# Altium schematic sheet RK3568-SOM-MAIN.SchDoc
size A2; Organization: Altium Limited; Address1: L3, 12a Rodborough Rd; Address2: Frenchs Forest; Address3: NSW; Address4: Australia 2086
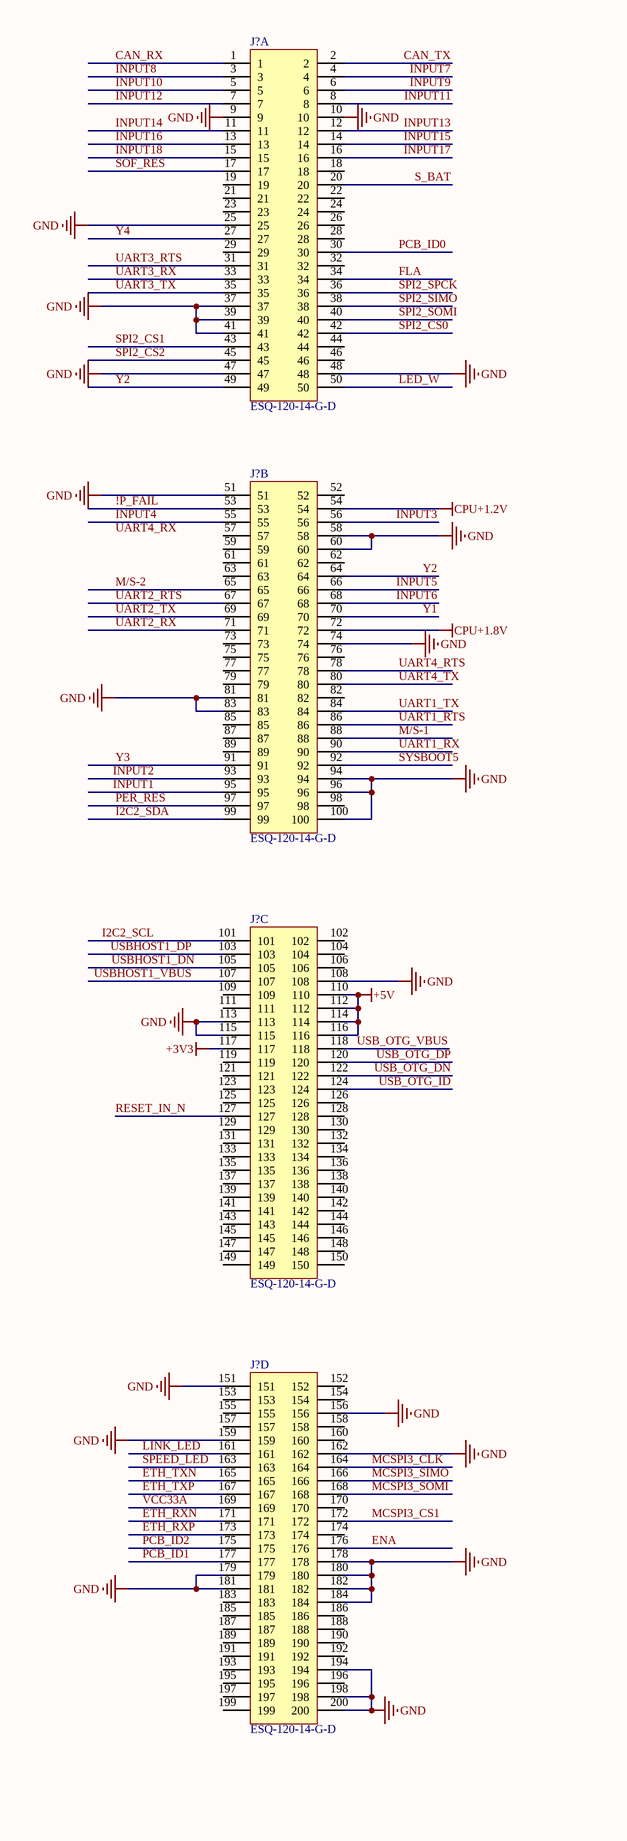
[diagram p0: RK3568-SOM-MAIN.SchDoc, left]
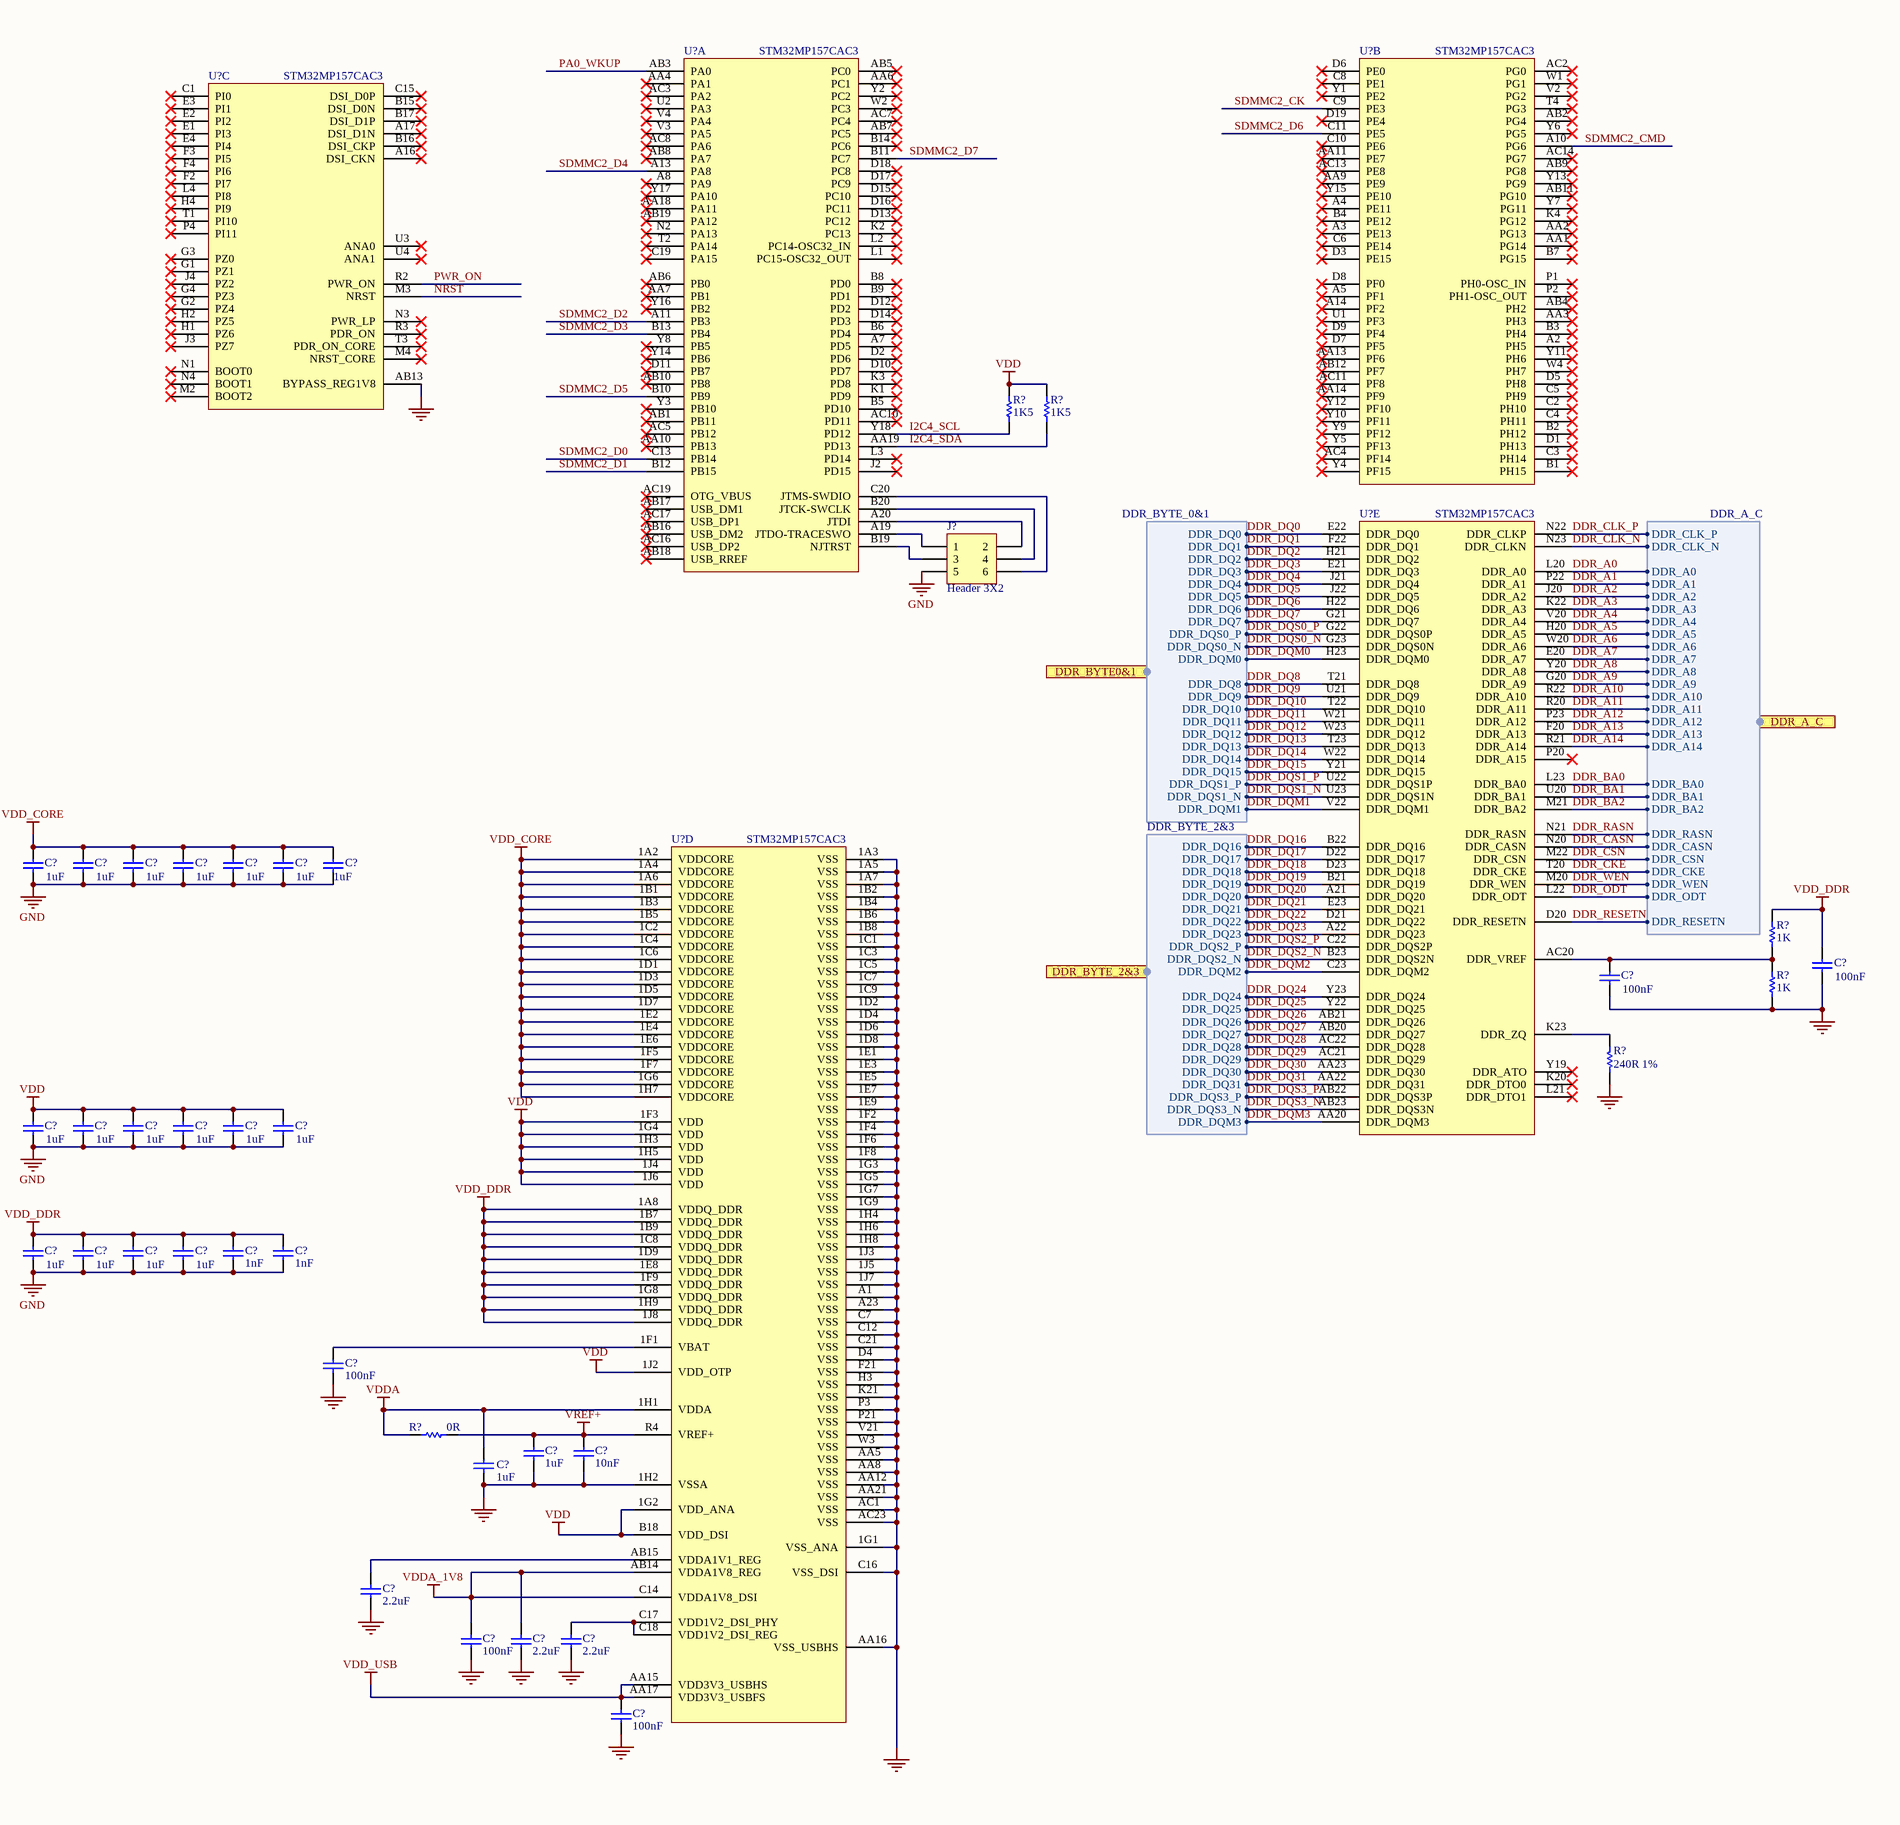
[diagram p1: RK3568-SOM-MAIN.SchDoc, right]

## Parts
(Parts that share a designator on the sheet are numbered #1, #2 ... from top to bottom, then left to right.)
C?#1  value 1uF  [C0402]  (hidden comment: Capacitor)
C?#2  value 1uF  [C0402]  (hidden comment: Capacitor)
C?#3  value 1uF  [C0402]  (hidden comment: Capacitor)
C?#4  value 1uF  [C0402]  (hidden comment: Capacitor)
C?#5  value 1uF  [C0402]  (hidden comment: Capacitor)
C?#6  value 1uF  [C0402]  (hidden comment: Capacitor)
C?#7  value 1uF  [C0402]  (hidden comment: Capacitor)
C?#8  value 100nF  [C0402]  (hidden comment: Capacitor)
C?#9  value 100nF  [C0402]  (hidden comment: Capacitor)
C?#10  value 1uF  [C0402]  (hidden comment: Capacitor)
C?#11  value 1uF  [C0402]  (hidden comment: Capacitor)
C?#12  value 1uF  [C0402]  (hidden comment: Capacitor)
C?#13  value 1uF  [C0402]  (hidden comment: Capacitor)
C?#14  value 1uF  [C0402]  (hidden comment: Capacitor)
C?#15  value 1uF  [C0402]  (hidden comment: Capacitor)
C?#16  value 1uF  [C0402]  (hidden comment: Capacitor)
C?#17  value 1uF  [C0402]  (hidden comment: Capacitor)
C?#18  value 1uF  [C0402]  (hidden comment: Capacitor)
C?#19  value 1uF  [C0402]  (hidden comment: Capacitor)
C?#20  value 1nF  [C0402]  (hidden comment: Capacitor)
C?#21  value 1nF  [C0402]  (hidden comment: Capacitor)
C?#22  value 100nF  [C0402]  (hidden comment: Capacitor)
C?#23  value 1uF  [C0402]  (hidden comment: Capacitor)
C?#24  value 10nF  [C0402]  (hidden comment: Capacitor)
C?#25  value 1uF  [C0402]  (hidden comment: Capacitor)
C?#26  value 2.2uF  [C0402]  (hidden comment: Capacitor)
C?#27  value 100nF  [C0402]  (hidden comment: Capacitor)
C?#28  value 2.2uF  [C0402]  (hidden comment: Capacitor)
C?#29  value 2.2uF  [C0402]  (hidden comment: Capacitor)
C?#30  value 100nF  [C0402]  (hidden comment: Capacitor)
J?#1  ESQ-120-14-G-D  [ESQ-120-14-G-D]  (part A of 4)
J?#2  Header 3X2  [Header3x2]
J?#3  ESQ-120-14-G-D  [ESQ-120-14-G-D]  (part B of 4)
J?#4  ESQ-120-14-G-D  [ESQ-120-14-G-D]  (part C of 4)
J?#5  ESQ-120-14-G-D  [ESQ-120-14-G-D]  (part D of 4)
R?#1  value 1K5  [R0402]  (hidden comment: Resistor)
R?#2  value 1K5  [R0402]  (hidden comment: Resistor)
R?#3  value 1K  [R0402]  (hidden comment: Resistor)
R?#4  value 1K  [R0402]  (hidden comment: Resistor)
R?#5  value 240R 1%  [R0402]  (hidden comment: Resistor)
R?#6  value 0R  [R0402]  (hidden comment: Resistor)
U?#1  STM32MP157CAC3  [ICC_TFBGA361_12X12_STM32MP157CAC3_P050-065]  (part A of 5)
U?#2  STM32MP157CAC3  [ICC_TFBGA361_12X12_STM32MP157CAC3_P050-065]  (part B of 5)
U?#3  STM32MP157CAC3  [ICC_TFBGA361_12X12_STM32MP157CAC3_P050-065]  (part C of 5)
U?#4  STM32MP157CAC3  [ICC_TFBGA361_12X12_STM32MP157CAC3_P050-065]  (part E of 5)
U?#5  STM32MP157CAC3  [ICC_TFBGA361_12X12_STM32MP157CAC3_P050-065]  (part D of 5)

## Ports
DDR_A_C (harness DDR_A_C), DDR_BYTE0&1 (harness DDR_BYTE_0&1), DDR_BYTE_2&3 (harness DDR_BYTE_2&3)

## Harnesses
DDR_BYTE_0&1: DDR_DQ0, DDR_DQ1, DDR_DQ2, DDR_DQ3, DDR_DQ4, DDR_DQ5, DDR_DQ6, DDR_DQ7, DDR_DQS0_P, DDR_DQS0_N, DDR_DQM0, DDR_DQ8, DDR_DQ9, DDR_DQ10, DDR_DQ11, DDR_DQ12, DDR_DQ13, DDR_DQ14, DDR_DQ15, DDR_DQS1_P, DDR_DQS1_N, DDR_DQM1
DDR_A_C: DDR_CLK_P, DDR_CLK_N, DDR_A0, DDR_A1, DDR_A2, DDR_A3, DDR_A4, DDR_A5, DDR_A6, DDR_A7, DDR_A8, DDR_A9, DDR_A10, DDR_A11, DDR_A12, DDR_A13, DDR_A14, DDR_BA0, DDR_BA1, DDR_BA2, DDR_RASN, DDR_CASN, DDR_CSN, DDR_CKE, DDR_WEN, DDR_ODT, DDR_RESETN
DDR_BYTE_2&3: DDR_DQ16, DDR_DQ17, DDR_DQ18, DDR_DQ19, DDR_DQ20, DDR_DQ21, DDR_DQ22, DDR_DQ23, DDR_DQS2_P, DDR_DQS2_N, DDR_DQM2, DDR_DQ24, DDR_DQ25, DDR_DQ26, DDR_DQ27, DDR_DQ28, DDR_DQ29, DDR_DQ30, DDR_DQ31, DDR_DQS3_P, DDR_DQS3_N, DDR_DQM3

## Nets
+3V3: J?#4.117
+5V: J?#4.110 J?#4.112 J?#4.114 J?#4.116
CPU+1.2V: J?#3.54
CPU+1.8V: J?#3.72
GND: C?#1.1 C?#2.1 C?#3.1 C?#4.1 C?#5.1 C?#6.1 C?#7.1 C?#8.1 C?#9.1 C?#10.1 C?#11.1 C?#12.1 C?#13.1 C?#14.1 C?#15.1 C?#16.1 C?#17.1 C?#18.1 C?#19.1 C?#20.1 C?#21.1 C?#22.1 C?#23.1 C?#24.1 C?#25.1 C?#26.1 C?#27.1 C?#28.1 C?#29.1 C?#30.1 J?#1.9 J?#1.10 J?#1.25 J?#1.37 J?#1.39 J?#1.41 J?#1.47 J?#1.48 J?#2.5 J?#3.51 J?#3.58 J?#3.60 J?#3.74 J?#3.81 J?#3.83 J?#3.94 J?#3.96 J?#3.100 J?#4.108 J?#4.113 J?#4.115 J?#5.151 J?#5.156 J?#5.159 J?#5.162 J?#5.178 J?#5.179 J?#5.180 J?#5.181 J?#5.182 J?#5.184 J?#5.194 J?#5.198 J?#5.200 R?#4.1 R?#5.2 U?#3.AB13(BYPASS_REG1V8) U?#5.1A3(VSS) U?#5.1A5(VSS) U?#5.1A7(VSS) U?#5.1B2(VSS) U?#5.1B4(VSS) U?#5.1B6(VSS) U?#5.1B8(VSS) U?#5.1C1(VSS) U?#5.1C3(VSS) U?#5.1C5(VSS) U?#5.1C7(VSS) U?#5.1C9(VSS) U?#5.1D2(VSS) U?#5.1D4(VSS) U?#5.1D6(VSS) U?#5.1D8(VSS) U?#5.1E1(VSS) U?#5.1E3(VSS) U?#5.1E5(VSS) U?#5.1E7(VSS) U?#5.1E9(VSS) U?#5.1F2(VSS) U?#5.1F4(VSS) U?#5.1F6(VSS) U?#5.1F8(VSS) U?#5.1G1(VSS_ANA) U?#5.1G3(VSS) U?#5.1G5(VSS) U?#5.1G7(VSS) U?#5.1G9(VSS) U?#5.1H2(VSSA) U?#5.1H4(VSS) U?#5.1H6(VSS) U?#5.1H8(VSS) U?#5.1J3(VSS) U?#5.1J5(VSS) U?#5.1J7(VSS) U?#5.A1(VSS) U?#5.A23(VSS) U?#5.AA5(VSS) U?#5.AA8(VSS) U?#5.AA12(VSS) U?#5.AA16(VSS_USBHS) U?#5.AA21(VSS) U?#5.AC1(VSS) U?#5.AC23(VSS) U?#5.C7(VSS) U?#5.C12(VSS) U?#5.C16(VSS_DSI) U?#5.C21(VSS) U?#5.D4(VSS) U?#5.F21(VSS) U?#5.H3(VSS) U?#5.K21(VSS) U?#5.P3(VSS) U?#5.P21(VSS) U?#5.V21(VSS) U?#5.W3(VSS)
VDD: C?#10.2 C?#11.2 C?#12.2 C?#13.2 C?#14.2 C?#15.2 R?#1.1 R?#2.1 U?#5.1F3(VDD) U?#5.1G2(VDD_ANA) U?#5.1G4(VDD) U?#5.1H3(VDD) U?#5.1H5(VDD) U?#5.1J2(VDD_OTP) U?#5.1J4(VDD) U?#5.1J6(VDD) U?#5.B18(VDD_DSI)
VDD_CORE: C?#1.2 C?#2.2 C?#3.2 C?#4.2 C?#5.2 C?#6.2 C?#7.2 U?#5.1A2(VDDCORE) U?#5.1A4(VDDCORE) U?#5.1A6(VDDCORE) U?#5.1B1(VDDCORE) U?#5.1B3(VDDCORE) U?#5.1B5(VDDCORE) U?#5.1C2(VDDCORE) U?#5.1C4(VDDCORE) U?#5.1C6(VDDCORE) U?#5.1D1(VDDCORE) U?#5.1D3(VDDCORE) U?#5.1D5(VDDCORE) U?#5.1D7(VDDCORE) U?#5.1E2(VDDCORE) U?#5.1E4(VDDCORE) U?#5.1E6(VDDCORE) U?#5.1F5(VDDCORE) U?#5.1F7(VDDCORE) U?#5.1G6(VDDCORE) U?#5.1H7(VDDCORE)
VDD_DDR: C?#8.2 C?#16.2 C?#17.2 C?#18.2 C?#19.2 C?#20.2 C?#21.2 R?#3.2 U?#5.1A8(VDDQ_DDR) U?#5.1B7(VDDQ_DDR) U?#5.1B9(VDDQ_DDR) U?#5.1C8(VDDQ_DDR) U?#5.1D9(VDDQ_DDR) U?#5.1E8(VDDQ_DDR) U?#5.1F9(VDDQ_DDR) U?#5.1G8(VDDQ_DDR) U?#5.1H9(VDDQ_DDR) U?#5.1J8(VDDQ_DDR)
VDD_USB: C?#30.2 U?#5.AA15(VDD3V3_USBHS) U?#5.AA17(VDD3V3_USBFS)
VDDA: C?#25.2 R?#6.1 U?#5.1H1(VDDA)
VDDA_1V8: C?#27.2 C?#28.2 U?#5.AB14(VDDA1V8_REG) U?#5.C14(VDDA1V8_DSI)
VREF+: C?#23.2 C?#24.2 R?#6.2 U?#5.R4(VREF+)
!P_FAIL: J?#3.53
CAN_RX: J?#1.1
CAN_TX: J?#1.2
DDR_A0: U?#4.L20(DDR_A0) ; port DDR_A_C.DDR_A0
DDR_A1: U?#4.P22(DDR_A1) ; port DDR_A_C.DDR_A1
DDR_A2: U?#4.J20(DDR_A2) ; port DDR_A_C.DDR_A2
DDR_A3: U?#4.K22(DDR_A3) ; port DDR_A_C.DDR_A3
DDR_A4: U?#4.V20(DDR_A4) ; port DDR_A_C.DDR_A4
DDR_A5: U?#4.H20(DDR_A5) ; port DDR_A_C.DDR_A5
DDR_A6: U?#4.W20(DDR_A6) ; port DDR_A_C.DDR_A6
DDR_A7: U?#4.E20(DDR_A7) ; port DDR_A_C.DDR_A7
DDR_A8: U?#4.Y20(DDR_A8) ; port DDR_A_C.DDR_A8
DDR_A9: U?#4.G20(DDR_A9) ; port DDR_A_C.DDR_A9
DDR_A10: U?#4.R22(DDR_A10) ; port DDR_A_C.DDR_A10
DDR_A11: U?#4.R20(DDR_A11) ; port DDR_A_C.DDR_A11
DDR_A12: U?#4.P23(DDR_A12) ; port DDR_A_C.DDR_A12
DDR_A13: U?#4.F20(DDR_A13) ; port DDR_A_C.DDR_A13
DDR_A14: U?#4.R21(DDR_A14) ; port DDR_A_C.DDR_A14
DDR_BA0: U?#4.L23(DDR_BA0) ; port DDR_A_C.DDR_BA0
DDR_BA1: U?#4.U20(DDR_BA1) ; port DDR_A_C.DDR_BA1
DDR_BA2: U?#4.M21(DDR_BA2) ; port DDR_A_C.DDR_BA2
DDR_CASN: U?#4.N20(DDR_CASN) ; port DDR_A_C.DDR_CASN
DDR_CKE: U?#4.T20(DDR_CKE) ; port DDR_A_C.DDR_CKE
DDR_CLK_N: U?#4.N23(DDR_CLKN) ; port DDR_A_C.DDR_CLK_N
DDR_CLK_P: U?#4.N22(DDR_CLKP) ; port DDR_A_C.DDR_CLK_P
DDR_CSN: U?#4.M22(DDR_CSN) ; port DDR_A_C.DDR_CSN
DDR_DQ0: U?#4.E22(DDR_DQ0) ; port DDR_BYTE0&1.DDR_DQ0
DDR_DQ1: U?#4.F22(DDR_DQ1) ; port DDR_BYTE0&1.DDR_DQ1
DDR_DQ2: U?#4.H21(DDR_DQ2) ; port DDR_BYTE0&1.DDR_DQ2
DDR_DQ3: U?#4.E21(DDR_DQ3) ; port DDR_BYTE0&1.DDR_DQ3
DDR_DQ4: U?#4.J21(DDR_DQ4) ; port DDR_BYTE0&1.DDR_DQ4
DDR_DQ5: U?#4.J22(DDR_DQ5) ; port DDR_BYTE0&1.DDR_DQ5
DDR_DQ6: U?#4.H22(DDR_DQ6) ; port DDR_BYTE0&1.DDR_DQ6
DDR_DQ7: U?#4.G21(DDR_DQ7) ; port DDR_BYTE0&1.DDR_DQ7
DDR_DQ8: U?#4.T21(DDR_DQ8) ; port DDR_BYTE0&1.DDR_DQ8
DDR_DQ9: U?#4.U21(DDR_DQ9) ; port DDR_BYTE0&1.DDR_DQ9
DDR_DQ10: U?#4.T22(DDR_DQ10) ; port DDR_BYTE0&1.DDR_DQ10
DDR_DQ11: U?#4.W21(DDR_DQ11) ; port DDR_BYTE0&1.DDR_DQ11
DDR_DQ12: U?#4.W23(DDR_DQ12) ; port DDR_BYTE0&1.DDR_DQ12
DDR_DQ13: U?#4.T23(DDR_DQ13) ; port DDR_BYTE0&1.DDR_DQ13
DDR_DQ14: U?#4.W22(DDR_DQ14) ; port DDR_BYTE0&1.DDR_DQ14
DDR_DQ15: U?#4.Y21(DDR_DQ15) ; port DDR_BYTE0&1.DDR_DQ15
DDR_DQ16: U?#4.B22(DDR_DQ16) ; port DDR_BYTE_2&3.DDR_DQ16
DDR_DQ17: U?#4.D22(DDR_DQ17) ; port DDR_BYTE_2&3.DDR_DQ17
DDR_DQ18: U?#4.D23(DDR_DQ18) ; port DDR_BYTE_2&3.DDR_DQ18
DDR_DQ19: U?#4.B21(DDR_DQ19) ; port DDR_BYTE_2&3.DDR_DQ19
DDR_DQ20: U?#4.A21(DDR_DQ20) ; port DDR_BYTE_2&3.DDR_DQ20
DDR_DQ21: U?#4.E23(DDR_DQ21) ; port DDR_BYTE_2&3.DDR_DQ21
DDR_DQ22: U?#4.D21(DDR_DQ22) ; port DDR_BYTE_2&3.DDR_DQ22
DDR_DQ23: U?#4.A22(DDR_DQ23) ; port DDR_BYTE_2&3.DDR_DQ23
DDR_DQ24: U?#4.Y23(DDR_DQ24) ; port DDR_BYTE_2&3.DDR_DQ24
DDR_DQ25: U?#4.Y22(DDR_DQ25) ; port DDR_BYTE_2&3.DDR_DQ25
DDR_DQ26: U?#4.AB21(DDR_DQ26) ; port DDR_BYTE_2&3.DDR_DQ26
DDR_DQ27: U?#4.AB20(DDR_DQ27) ; port DDR_BYTE_2&3.DDR_DQ27
DDR_DQ28: U?#4.AC22(DDR_DQ28) ; port DDR_BYTE_2&3.DDR_DQ28
DDR_DQ29: U?#4.AC21(DDR_DQ29) ; port DDR_BYTE_2&3.DDR_DQ29
DDR_DQ30: U?#4.AA23(DDR_DQ30) ; port DDR_BYTE_2&3.DDR_DQ30
DDR_DQ31: U?#4.AA22(DDR_DQ31) ; port DDR_BYTE_2&3.DDR_DQ31
DDR_DQM0: U?#4.H23(DDR_DQM0) ; port DDR_BYTE0&1.DDR_DQM0
DDR_DQM1: U?#4.V22(DDR_DQM1) ; port DDR_BYTE0&1.DDR_DQM1
DDR_DQM2: U?#4.C23(DDR_DQM2) ; port DDR_BYTE_2&3.DDR_DQM2
DDR_DQM3: U?#4.AA20(DDR_DQM3) ; port DDR_BYTE_2&3.DDR_DQM3
DDR_DQS0_N: U?#4.G23(DDR_DQS0N) ; port DDR_BYTE0&1.DDR_DQS0_N
DDR_DQS0_P: U?#4.G22(DDR_DQS0P) ; port DDR_BYTE0&1.DDR_DQS0_P
DDR_DQS1_N: U?#4.U23(DDR_DQS1N) ; port DDR_BYTE0&1.DDR_DQS1_N
DDR_DQS1_P: U?#4.U22(DDR_DQS1P) ; port DDR_BYTE0&1.DDR_DQS1_P
DDR_DQS2_N: U?#4.B23(DDR_DQS2N) ; port DDR_BYTE_2&3.DDR_DQS2_N
DDR_DQS2_P: U?#4.C22(DDR_DQS2P) ; port DDR_BYTE_2&3.DDR_DQS2_P
DDR_DQS3_N: U?#4.AB23(DDR_DQS3N) ; port DDR_BYTE_2&3.DDR_DQS3_N
DDR_DQS3_P: U?#4.AB22(DDR_DQS3P) ; port DDR_BYTE_2&3.DDR_DQS3_P
DDR_ODT: U?#4.L22(DDR_ODT) ; port DDR_A_C.DDR_ODT
DDR_RASN: U?#4.N21(DDR_RASN) ; port DDR_A_C.DDR_RASN
DDR_RESETN: U?#4.D20(DDR_RESETN) ; port DDR_A_C.DDR_RESETN
DDR_WEN: U?#4.M20(DDR_WEN) ; port DDR_A_C.DDR_WEN
ENA: J?#5.176
ETH_RXN: J?#5.171
ETH_RXP: J?#5.173
ETH_TXN: J?#5.165
ETH_TXP: J?#5.167
FLA: J?#1.34
I2C2_SCL: J?#4.101
I2C2_SDA: J?#3.99
I2C4_SCL: R?#1.2 U?#1.Y18(PD12)
I2C4_SDA: R?#2.2 U?#1.AA19(PD13)
INPUT1: J?#3.95
INPUT2: J?#3.93
INPUT3: J?#3.56
INPUT4: J?#3.55
INPUT5: J?#3.66
INPUT6: J?#3.68
INPUT7: J?#1.4
INPUT8: J?#1.3
INPUT9: J?#1.6
INPUT10: J?#1.5
INPUT11: J?#1.8
INPUT12: J?#1.7
INPUT13: J?#1.12
INPUT14: J?#1.11
INPUT15: J?#1.14
INPUT16: J?#1.13
INPUT17: J?#1.16
INPUT18: J?#1.15
LED_W: J?#1.50
LINK_LED: J?#5.161
M/S-1: J?#3.88
M/S-2: J?#3.65
MCSPI3_CLK: J?#5.164
MCSPI3_CS1: J?#5.172
MCSPI3_SIMO: J?#5.166
MCSPI3_SOMI: J?#5.168
NRST: U?#3.M3(NRST)
PA0_WKUP: U?#1.AB3(PA0)
PCB_ID0: J?#1.30
PCB_ID1: J?#5.177
PCB_ID2: J?#5.175
PER_RES: J?#3.97
PWR_ON: U?#3.R2(PWR_ON)
RESET_IN_N: J?#4.127
S_BAT: J?#1.20
SDMMC2_CK: U?#2.C9(PE3)
SDMMC2_CMD: U?#2.A10(PG6)
SDMMC2_D0: U?#1.C13(PB14)
SDMMC2_D1: U?#1.B12(PB15)
SDMMC2_D2: U?#1.A11(PB3)
SDMMC2_D3: U?#1.B13(PB4)
SDMMC2_D4: U?#1.A13(PA8)
SDMMC2_D5: U?#1.B10(PB9)
SDMMC2_D6: U?#2.C11(PE5)
SDMMC2_D7: U?#1.B11(PC7)
SOF_RES: J?#1.17
SPEED_LED: J?#5.163
SPI2_CS0: J?#1.42
SPI2_CS1: J?#1.43
SPI2_CS2: J?#1.45
SPI2_SIMO: J?#1.38
SPI2_SOMI: J?#1.40
SPI2_SPCK: J?#1.36
SYSBOOT5: J?#3.92
UART1_RTS: J?#3.86
UART1_RX: J?#3.90
UART1_TX: J?#3.84
UART2_RTS: J?#3.67
UART2_RX: J?#3.71
UART2_TX: J?#3.69
UART3_RTS: J?#1.31
UART3_RX: J?#1.33
UART3_TX: J?#1.35
UART4_RTS: J?#3.78
UART4_TX: J?#3.80
USB_OTG_DN: J?#4.122
USB_OTG_DP: J?#4.120
USB_OTG_ID: J?#4.124
USB_OTG_VBUS: J?#4.118
USBHOST1_DN: J?#4.105
USBHOST1_DP: J?#4.103
USBHOST1_VBUS: J?#4.107
VCC33A: J?#5.169
Y1: J?#3.70
Y2: J?#1.49 J?#3.64
Y3: J?#3.91
Y4: J?#1.27
NetC?#9_2: C?#9.2 R?#3.1 R?#4.2 U?#4.AC20(DDR_VREF)
NetC?#22_2: C?#22.2 U?#5.1F1(VBAT)
NetC?#26_2: C?#26.2 U?#5.AB15(VDDA1V1_REG)
NetC?#29_2: C?#29.2 U?#5.C17(VDD1V2_DSI_PHY) U?#5.C18(VDD1V2_DSI_REG)
NetJ?#2_1: J?#2.1 U?#1.A19(JTDO-TRACESWO)
NetJ?#2_2: J?#2.2 U?#1.A20(JTDI)
NetJ?#2_3: J?#2.3 U?#1.B19(NJTRST)
NetJ?#2_4: J?#2.4 U?#1.B20(JTCK-SWCLK)
NetJ?#2_6: J?#2.6 U?#1.C20(JTMS-SWDIO)
NetR?#5_1: R?#5.1 U?#4.K23(DDR_ZQ)

Not connected (* = marked no-connect by the designer): J?#1 18 19 21 22 23 24 26 28 29 32 44 46; J?#3 52 57 59 61 62 63 73 75 76 77 79 82 85 87 89 98; J?#4 102 104 106 109 111 119 121 123 125 126 128 129 130 131 132 133 134 135 136 137 138 139 140 141 142 143 144 145 146 147 148 149 150; J?#5 152 153 154 155 157 158 160 170 174 183 185 186 187 188 189 190 191 192 193 195 196 197 199; U?#1 A7(PD5)* A8(PA9)* AA4(PA1)* AA6(PC1)* AA7(PB1)* AA10(PB13)* AA18(PA11)* AB1(PB11)* AB5(PC0)* AB6(PB0)* AB7(PC5)* AB8(PA7)* AB10(PB8)* AB16(USB_DM2)* AB17(USB_DM1)* AB18(USB_RREF)* AB19(PA12)* AC3(PA2)* AC5(PB12)* AC7(PC4)* AC8(PA6)* AC10(PD11)* AC16(USB_DP2)* AC17(USB_DP1)* AC19(OTG_VBUS)* B5(PD10)* B6(PD4)* B8(PD0)* B9(PD1)* B14(PC6)* C19(PA15)* D2(PD6)* D10(PD7)* D11(PB7)* D12(PD2)* D13(PC12)* D14(PD3)* D15(PC10)* D16(PC11)* D17(PC9)* D18(PC8)* J2(PD15)* K1(PD9)* K2(PC13)* K3(PD8)* L1(PC15-OSC32_OUT)* L2(PC14-OSC32_IN)* L3(PD14)* N2(PA13)* T2(PA14)* U2(PA3)* V3(PA5)* V4(PA4)* W2(PC3)* Y2(PC2)* Y3(PB10)* Y8(PB5)* Y14(PB6)* Y16(PB2)* Y17(PA10)*; U?#2 A2(PH5)* A3(PE13)* A4(PE11)* A5(PF1)* A14(PF2)* AA1(PG14)* AA2(PG13)* AA3(PH3)* AA9(PE9)* AA11(PE7)* AA13(PF6)* AA14(PF9)* AB2(PG4)* AB4(PH2)* AB9(PG8)* AB11(PG10)* AB12(PF7)* AC2(PG0)* AC4(PF14)* AC11(PF8)* AC13(PE8)* AC14(PG7)* B1(PH15)* B2(PH12)* B3(PH4)* B4(PE12)* B7(PG15)* C2(PH10)* C3(PH14)* C4(PH11)* C5(PH9)* C6(PE14)* C8(PE1)* C10(PE6)* D1(PH13)* D3(PE15)* D5(PH8)* D6(PE0)* D7(PF5)* D8(PF0)* D9(PF4)* D19(PE4)* K4(PG12)* P1(PH0-OSC_IN)* P2(PH1-OSC_OUT)* T4(PG3)* U1(PF3)* V2(PG2)* W1(PG1)* W4(PH7)* Y1(PE2)* Y4(PF15)* Y5(PF13)* Y6(PG5)* Y7(PG11)* Y9(PF12)* Y10(PF11)* Y11(PH6)* Y12(PF10)* Y13(PG9)* Y15(PE10)*; U?#3 A16(DSI_CKN)* A17(DSI_D1N)* B15(DSI_D0N)* B16(DSI_CKP)* B17(DSI_D1P)* C1(PI0)* C15(DSI_D0P)* E1(PI3)* E2(PI2)* E3(PI1)* E4(PI4)* F2(PI7)* F3(PI5)* F4(PI6)* G1(PZ1)* G2(PZ4)* G3(PZ0)* G4(PZ3)* H1(PZ6)* H2(PZ5)* H4(PI9)* J3(PZ7)* J4(PZ2)* L4(PI8)* M2(BOOT2)* M4(NRST_CORE)* N1(BOOT0)* N3(PWR_LP)* N4(BOOT1)* P4(PI11)* R3(PDR_ON)* T1(PI10)* T3(PDR_ON_CORE)* U3(ANA0)* U4(ANA1)*; U?#4 K20(DDR_DTO0)* L21(DDR_DTO1)* P20(DDR_A15)* Y19(DDR_ATO)*

## Notes on the sheet
- Labels drawn without touching a wire or pin: UART4_RX
- Title
- Size:
- Date:
- File:
- A2
- Number:
- Time:
- Revision:
- Sheet
- of

## Library data of the parts
C?#1-C?#7 C?#10-C?#19 C?#23 C?#25 = MCD-00095: Capacitor, MLCC, 1uF, 25V, X5R, +/-10%, 0402, T=0,5mm; Manufacturer_Part_Number: GRM155R61E105KA12; Manufacturer: MURATA; Alternate_Manufacturer_Part_Number: GRM155R60J105KE19; ECCN_US: EAR99; ECCN_EU: NEC; Provided_By: SUBCO; Order_Code_RS: 846-7287; Internal_Part_Number: MCD-00095; Status: Released; Package: C0402; ComponentLink1Description: Datasheet; Part_Type: Capacitor; Alternate_Manufacturer: MURATA; ComponentLink1URL: http://tunmcdsvn.tun.st.com/Component_Datasheet_Library/Trunk/Capacitors/Murata_Capacitor_GR_series; Order_Code_Digikey: 490-10017-1-ND; Order_Code_Farnell: 2218855
C?#8 C?#9 C?#22 C?#30 = MCD-00006: Capacitor, MLCC, 100nF, 16V, X7R, +/-10%, 0402, T=0.5mm; Manufacturer_Part_Number: CC0402KRX7R7BB104; Manufacturer: YAGEO; Alternate_Manufacturer: MURATA; Alternate_Manufacturer_Part_Number: GCM155R71C104KA55D; ECCN_US: EAR99; ECCN_EU: NEC; Provided_By: SUBCO; Order_Code_RS: 616-9701; Internal_Part_Number: MCD-00006; ComponentLink1Description: Datasheet; Status: Released; Part_Type: Capacitor; Package: C0402; ComponentLink1URL: http://tunmcdsvn.tun.st.com/Component_Datasheet_Library/Trunk/Capacitors/Yageo_Multilayer_Capacitor_X7R_series_100pF_to_22uF; Order_Code_Digikey: 311-1338-1-ND; Order_Code_Farnell: 9402047
C?#20 C?#21 = MCD-00198: Capacitor, MLCC, 1nF, 16V, X7R, +/-10%, 0402, T=0.5mm; Manufacturer_Part_Number: CC0402KRX7R7BB102; Manufacturer: YAGEO; Provided_By: SUBCO; ECCN_EU: NEC; ECCN_US: EAR99; Internal_Part_Number: MCD-00198; Status: Released; Part_Type: Capacitor; Package: C0402; ComponentLink1Description: Datasheet; ComponentLink1URL: http://tunmcdsvn.tun.st.com/Component_Datasheet_Library/Trunk/Capacitors/Yageo_Multilayer_Capacitor_X7R_series_100pF_to_22uF; Order_Code_Digikey: 311-1352-1-ND; Order_Code_Farnell: 2370642; Order_Code_RS: N/A
C?#24 = MCD-00011: Capacitor, MLCC, 10nF, 16V, X7R, +/-10%, 0402, T=0.5mm; Manufacturer_Part_Number: CC0402KRX7R7BB103; Manufacturer: YAGEO; ECCN_US: EAR99; ECCN_EU: NEC; Provided_By: SUBCO; Order_Code_RS: 669-8688; Internal_Part_Number: MCD-00011; Status: Released; Part_Type: Capacitor; Package: C0402; ComponentLink1Description: Datasheet; ComponentLink1URL: http://tunmcdsvn.tun.st.com/Component_Datasheet_Library/Trunk/Capacitors/Yageo_Multilayer_Capacitor_X7R_series_100pF_to_22uF; Order_Code_Digikey: 311-1042-1-ND; Order_Code_Farnell: 3019275
C?#26 C?#28 C?#29 = MCD-01823: Capacitor,MLCC, 2.2uF, 6V3, X5R,+/-10%, 0402, T=0.5mm; Manufacturer_Part_Number: GRM155R60J225KE95D; Manufacturer: MURATA; ECCN_US: EAR99; ECCN_EU: NEC; Provided_By: SUBCO; Order_Code_RS: 172-6478; Internal_Part_Number: MCD-01823; Status: Released; Part_Type: Capacitor; Package: C0402; ComponentLink1Description: Datasheet; ComponentLink1URL: http://tunmcdsvn.tun.st.com/Component_Datasheet_Library/Trunk/Capacitors/Murata_Capacitor_GR_series; Order_Code_Digikey: 490-12532-1-ND; Order_Code_Farnell: 2695865
C?#27 = MCD-00006: Capacitor, MLCC, 100nF, 16V, X7R, +/-10%, 0402, T=0.5mm; Manufacturer_Part_Number: CC0402KRX7R7BB104; Manufacturer: YAGEO; Alternate_Manufacturer_Part_Number: GCM155R71C104KA55D; Alternate_Manufacturer: MURATA; ECCN_US: EAR99; ECCN_EU: NEC; Provided_By: SUBCO; Order_Code_RS: 616-9701; Internal_Part_Number: MCD-00006; Status: Released; Part_Type: Capacitor; Package: C0402; ComponentLink1Description: Datasheet; ComponentLink1URL: http://tunmcdsvn.tun.st.com/Component_Datasheet_Library/Trunk/Capacitors/Yageo_Multilayer_Capacitor_X7R_series_100pF_to_22uF; Order_Code_Digikey: 311-1338-1-ND; Order_Code_Farnell: 9402047
J?#1 J?#3-J?#5 = SODIMM-SOCKET: CONN RCPT 40POS .100" DUAL GOLD; Manufacturer: TE Connectivity; Manufacturer Part Number: 1717254-4; Connector Type: Receptacle; Number of Positions: 200; Number of Positions Loaded: All; Pitch: 0.100" (2.54mm); .Creator: MM; Supplier 1: Digi-Key; RoHS: RoHS Compliant; Category: Connectors, Interconnects; Stock 1: 51; Pricing 1: 1=7.42, 10=6.864, 50=6.1586, 100=5.7505, 250=5.00852, 500=4.823, 1000=4.6375, 2500=4.452 (USD); Packaging: Tape & Reel; Contact Type: Female Socket; Number of Rows: 2; Row Spacing: 0.100" (2.54mm); Mounting Type: Through Hole; Termination: Solder; Fastening Type: -; Features: -; Contact Finish: Gold; Contact Finish Thickness: 20µin (0.51µm); Color: Black; ComponentLink1URL: https://www.te.com/usa-en/product-1717254-4.html; ComponentLink1Description: DataSheet; Supplier Part Number 1: SAM8767-ND; .Checked PCB: MM; .Checked SCH: MM
J?#2 = Header 3X2: Header, 2-Pin, Dual row; Manufacturer: Harwin; Manufacturer Part Number 1: M20-9980346; Part Description: Connector Header Through Hole 6 position 0.100" (2.54mm); Contact Resistance: 25mR; Max Current Rating: 3A; Number of Positions: 6; Gender: Male; Connector Type: Male Pin; Insulation Resistance: 10GR; Pitch: 2.54mm; Row Spacing: 0.1inch; Supplier 1: Digi-Key; Supplier Part Number 1: 952-2121-ND; RoHS: Yes; Stock 1: 46604; Pricing 1: 1 = 0,24000, 10 = 0,22900, 100 = 0,15860, 500 = 0,13420, 1000 = 0,10980, 5000 = 0,09760, 10000 = 0,08845 (USD); Mount: Through Hole; Color: Black; Contact Material: Brass,Bronze; Housing Color: Black; Housing Material: Nylon; Contact Plating: Tin; Min Operating Temperature: -40°C; Max Operating Temperature: 105°C; Package Quantity: 1000; Packaging: Bag; Termination: Solder; Number of Rows: 2; Number of Contacts: 6; Orientation: Straight; Current Rating: 3A; Length: 7.62mm; Depth: 5.08mm; Contact Mating Length: 0.24inch; Radiation Hardening: No; REACH SVHC: No SVHC; ComponentLink1URL: http://uk.rs-online.com/webdocs/1406/0900766b81406898.pdf; ComponentLink1Description: http://uk.rs-online.com/webdocs/1406/0900766b81406898.pdf; ComponentLink2URL: https://www.verical.com/server-webapp/html/getDatasheet?partID=483857; ComponentLink2Description: https://www.verical.com/server-webapp/html/getDatasheet?partID=483857; ComponentLink3URL: http://www.farnell.com/cad/112195.pdf; ComponentLink3Description: http://www.farnell.com/cad/112195.pdf
R?#1 R?#2 = MCD-00068: Resistor,1K5,0402,1%,1/16W; Manufacturer_Part_Number: RC0402FR-071K5L; Manufacturer: YAGEO; ECCN_US: EAR99; ECCN_EU: NEC; Provided_By: SUBCO; Internal_Part_Number: MCD-00068; ComponentLink1Description: Datasheet; Status: Released; Part_Type: Resistor; ComponentLink1URL: http://tunmcdsvn.tun.st.com/Component_Datasheet_Library/Trunk/Resistors/Yageo_Resistor_RC0402-series; Package: R0402; Order_Code_Digikey: 311-1.50KLRCT-ND; Order_Code_Farnell: 9239251; Order_Code_RS: N/A
R?#3 R?#4 = MCD-00061: Resistor,1K,0402,1%,1/16W; Manufacturer_Part_Number: RC0402FR-071KL; Manufacturer: YAGEO; Provided_By: SUBCO; ECCN_EU: NEC; ECCN_US: EAR99; Internal_Part_Number: MCD-00061; Status: Released; Part_Type: Resistor; Package: R0402; ComponentLink1Description: Datasheet; ComponentLink1URL: http://tunmcdsvn.tun.st.com/Component_Datasheet_Library/Trunk/Resistors/Yageo_Resistor_RC0402-series; Order_Code_Digikey: 311-1.00KLRCT-ND; Order_Code_Farnell: 9239235; Order_Code_RS: N/A
R?#5 = MCD-00120: Resistor,240R,0402,1%,1/16W; Manufacturer_Part_Number: RC0402FR-07240RL; Manufacturer: YAGEO; ECCN_US: EAR99; ECCN_EU: NEC; Provided_By: SUBCO; Internal_Part_Number: MCD-00120; ComponentLink1Description: Datasheet; Status: Released; Part_Type: Resistor; ComponentLink1URL: http://tunmcdsvn.tun.st.com/Component_Datasheet_Library/Trunk/Resistors/Yageo_Resistor_RC0402-series; Package: R0402; Order_Code_Digikey: 311-240LRCT-ND; Order_Code_Farnell: 1458766; Order_Code_RS: N/A
R?#6 = MCD-00052: Resistor,0R,0402,5%,1/16W; Manufacturer_Part_Number: RC0402JR-070RL; Manufacturer: YAGEO; ECCN_US: EAR99; ECCN_EU: NEC; Provided_By: SUBCO; Order_Code_RS: 618-5804; Internal_Part_Number: MCD-00052; Status: Released; Part_Type: Resistor; ComponentLink1Description: Datasheet; ComponentLink1URL: http://tunmcdsvn.tun.st.com/Component_Datasheet_Library/Trunk/Resistors/Yageo_Resistor_RC0402-series; Package: R0402; Order_Code_Digikey: 311-0.0JRCT-ND; Order_Code_Farnell: 9232516RL
U?#1-U?#5 = MCD-00677: MPU TFBGA12x12 secure boot+crypto; Part_Type: IC; Manufacturer: STMICROELECTRONICS; BMS_Part_Number: 9175503; ECCN_US: 5A002A4; ECCN_EU: NEC; Provided_By: SUBCO with ST control; Company_Nationality: Netherlands; Internal_Part_Number: MCD-00677; Value: STM32MP157CAC3; Status: Footprint available; Manufacturer_Part_Number: STM32MP157CAC3; ComponentLink1Description: Datasheet; ComponentLink1URL: http://tunmcdsvn.tun.st.com/Component_Datasheet_Library/Trunk/IC/STM_MPU_12x12_POA_DM00342580_POA12x12; Export_Juridiction: EU; California_Proposition_65: N/A